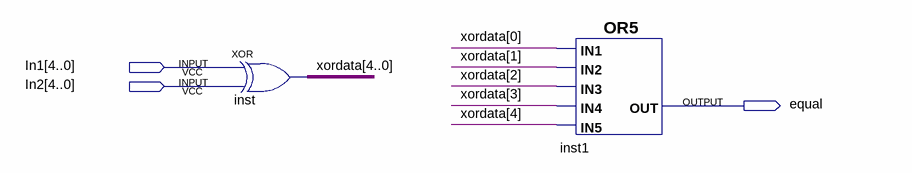
[diagram p0: schematic sheet]
// Quartus schematic OpcodeComparator.bdf as structural Verilog: 2 symbols, 3 pins
module OpcodeComparator (
  input  [4:0] In1,
  input  [4:0] In2,
  output equal
);

  wire [4:0] xordata;

  assign xordata = In1 ^ In2;  // XOR inst, 5 bits wide
  or inst1 (equal, xordata[0], xordata[1], xordata[2], xordata[3], xordata[4]);
endmodule
